# Altium schematic sheet robotShield_CPU.SchDoc
size A4; SheetNumber: 4; SheetTotal: 6
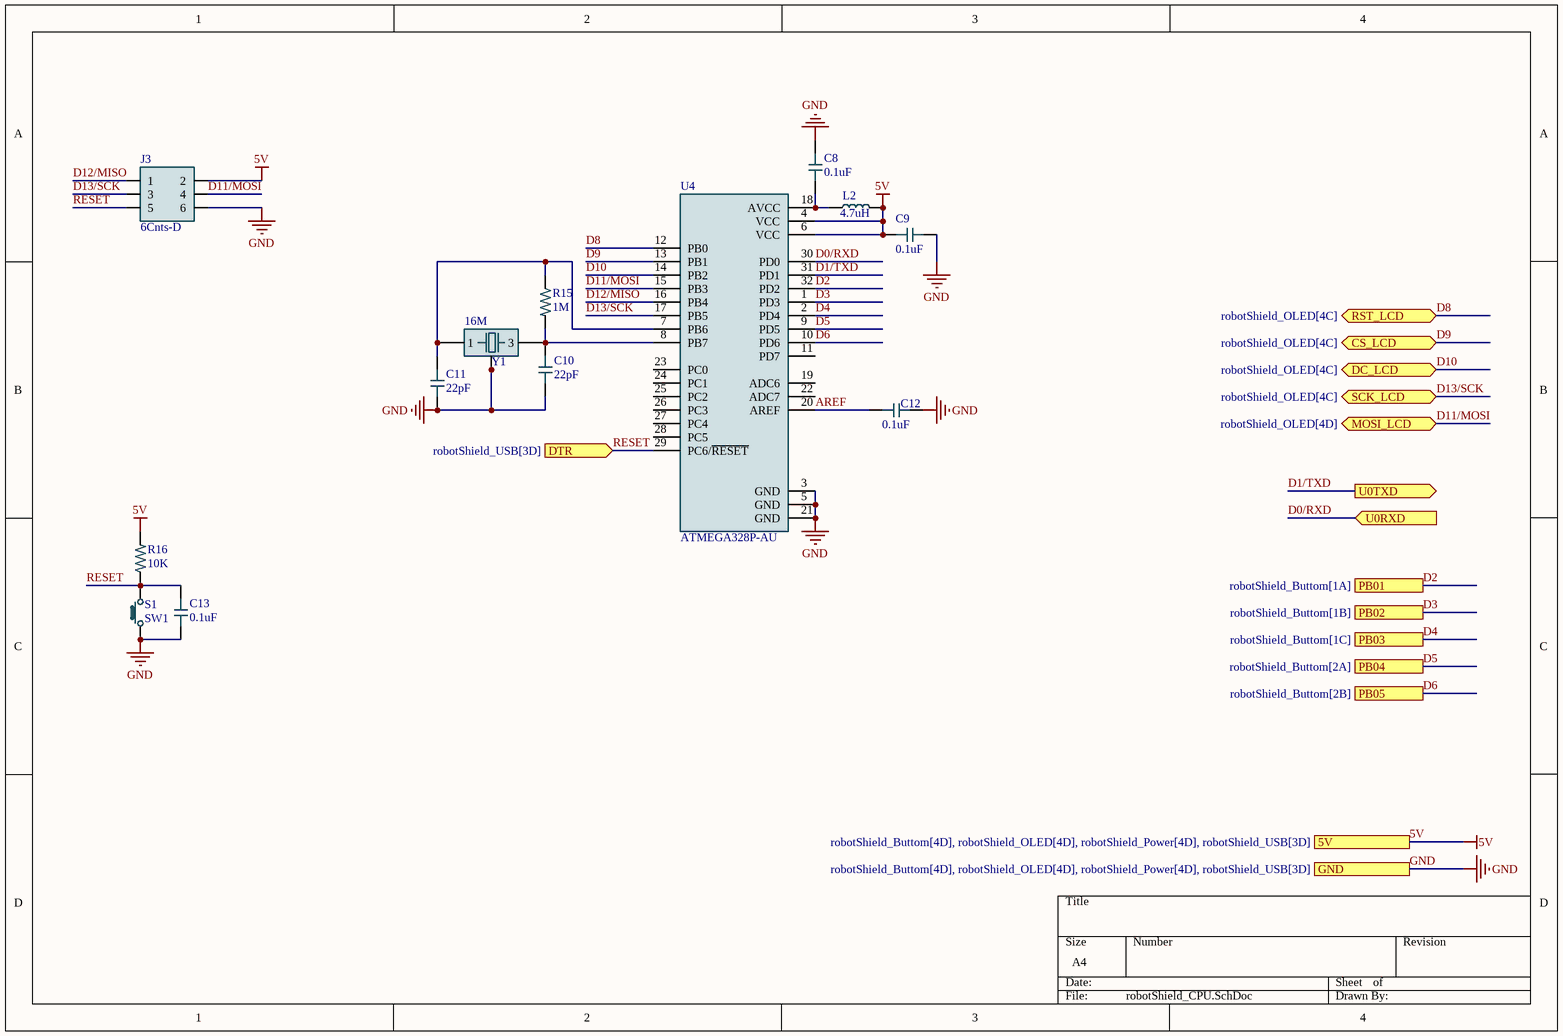
[diagram p0: robotShield_CPU.SchDoc]

## Parts
C8  0.1uF  [CAP0603]
C9  0.1uF  [CAP0603]
C10  22pF  [CAP0603]
C11  22pF  [CAP0603]
C12  0.1uF  [CAP0603]
C13  0.1uF  [CAP0603]
J3  6Cnts-D  [6Cnts-D-SMD]
L2  4.7uH  [Inductor0603]
R15  1M  [RES0603]
R16  10K  [RES0603]
S1  SW1  [Pushbutton_Tactile]
U4  ATMEGA328P-AU  [ATMEGA328P-AU]
Y1  16M  [crystal-2520]

## Ports
5V (see robotShield_Buttom[4D], robotShield_OLED[4D], robotShield_Power[4D], robotShield_USB[3D]), CS_LCD (bidir, see robotShield_OLED[4C]), DC_LCD (bidir, see robotShield_OLED[4C]), DTR (in, see robotShield_USB[3D]), GND (see robotShield_Buttom[4D], robotShield_OLED[4D], robotShield_Power[4D], robotShield_USB[3D]), MOSI_LCD (bidir, see robotShield_OLED[4D]), PB01 (see robotShield_Buttom[1A]), PB02 (see robotShield_Buttom[1B]), PB03 (see robotShield_Buttom[1C]), PB04 (see robotShield_Buttom[2A]), PB05 (see robotShield_Buttom[2B]), RST_LCD (bidir, see robotShield_OLED[4C]), SCK_LCD (bidir, see robotShield_OLED[4C]), U0RXD (in, see robotShield_USB[4A]), U0TXD (out, see robotShield_USB[4A])

## Nets
5V: C9.1 J3.2 L2.2 R16.2 U4.4(VCC) U4.6(VCC) ; port 5V
GND: C8.1 C9.2 C10.2 C11.2 C12.2 C13.2 J3.6 S1.1 U4.3(GND) U4.5(GND) U4.21(GND) Y1.2(GND) Y1.4(GND) ; port GND
AREF: C12.1 U4.20(AREF)
D0/RXD: U4.30(PD0) ; port U0RXD
D1/TXD: U4.31(PD1) ; port U0TXD
D2: U4.32(PD2) ; port PB01
D3: U4.1(PD3) ; port PB02
D4: U4.2(PD4) ; port PB03
D5: U4.9(PD5) ; port PB04
D6: U4.10(PD6) ; port PB05
D8: U4.12(PB0) ; port RST_LCD
D9: U4.13(PB1) ; port CS_LCD
D10: U4.14(PB2) ; port DC_LCD
D11/MOSI: J3.4 U4.15(PB3) ; port MOSI_LCD
D12/MISO: J3.1 U4.16(PB4)
D13/SCK: J3.3 U4.17(PB5) ; port SCK_LCD
RESET: C13.1 J3.5 R16.1 S1.2 U4.29(PC6/~{RESET}) ; port DTR
NetC8_2: C8.2 L2.1 U4.18(AVCC)
NetC10_1: C10.1 R15.2 U4.8(PB7) Y1.3
NetC11_1: C11.1 R15.1 U4.7(PB6) Y1.1

Not connected (* = marked no-connect by the designer): U4 11(PD7) 19(ADC6) 22(ADC7) 23(PC0) 24(PC1) 25(PC2) 26(PC3) 27(PC4) 28(PC5)

## Library data of the parts
C8-C13 = Capacitor: CAP SMD; MF: AVX; MP: LD031A101GAB2A; SnapEDA_Link: https://www.snapeda.com/parts/LD031A101GAB2A/AVX/view-part/1973966/?ref=snap; Price: None; Availability: Unavailable; Package: 0603 AVX; Value: *
J3 = 6Cnts-D: MP: MTSW-103-22-S-D-430; Package: None; Price: None; Value: *; Availability: Unavailable
L2 = Inductor: Inductor with Inductance 6.8uH Tol.+/-20%; MP: LQM18DN6R8M70B; Package: None; Price: None; Value: *; Availability: Unavailable
R15 R16 = Resistor: RES 0.27 OHM 1% 1/10W; Power_Rating: .1 W; MP: 3-1879460-5; Resistance: 27; MF: TE Connectivity; SnapEDA_Link: https://www.snapeda.com/parts/3-1879460-5/TE+Connectivity/view-part/?ref=snap; Package: 0603; Check_prices: https://www.snapeda.com/parts/3-1879460-5/TE+Connectivity/view-part/?ref=eda; EU_RoHS_Compliance: Compliant with Exemptions; Price: None; Tolerance: 1%; Availability: In Stock; Value: *
S1 = Pushbutton: Switch,Pushbutton,Tactile,SPST
U4 = ATMEGA328P-AU: AVR ATmega Microcontroller IC 8-Bit 20MHz 32KB (16K x 16) FLASH 32-TQFP (7x7); MF: Microchip; SnapEDA_Link: https://www.snapeda.com/parts/ATMEGA328P-AU/Microchip/view-part/?ref=snap; Package: TQFP-32 Microchip; Value: *; MP: ATMEGA328P-AU; Check_prices: https://www.snapeda.com/parts/ATMEGA328P-AU/Microchip/view-part/?ref=eda
Y1 = crystal-4P: 40MHz 10pF ±10ppm SMD-4P Crystals; MF: EPSON; MP: TSX-3225 16.0000MF18X-AC3; SnapEDA_Link: https://www.snapeda.com/parts/TSX-3225%2016.0000MF18X-AC3/EPSON/view-part/?ref=snap; Package: SMD-4 EPSON; Value: *; Check_prices: https://www.snapeda.com/parts/TSX-3225%2016.0000MF18X-AC3/EPSON/view-part/?ref=eda